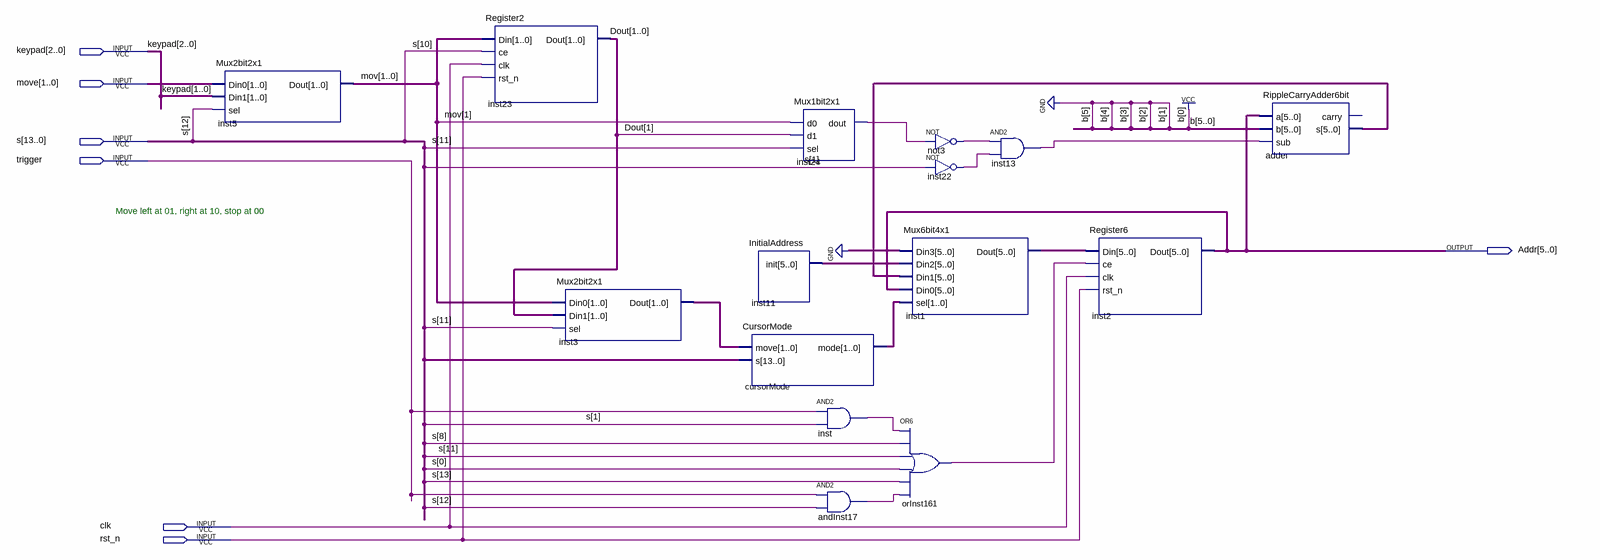
[diagram p0: schematic sheet]
// Quartus schematic Cursor.bdf as structural Verilog: 15 symbols, 7 pins
module Cursor (
  input  [2:0] keypad,
  input  [1:0] move,
  input  [13:0] s,
  input  trigger,
  input  clk,
  input  rst_n,
  output [5:0] Addr
);

  wire andInst17_out, inst13_out, inst22_out, inst24_dout, inst_out, not3_out, orInst161_out;
  wire [1:0] cursorMode_mode, Dout, inst3_dout, mov;
  wire [5:0] adder_s, inst1_dout, inst11_init;

  Mux2bit2x1 inst5 (.Din0(move), .Din1(keypad[1:0]), .sel(s[12]), .Dout(mov));
  Register2 inst23 (.Din(mov), .ce(s[10]), .clk(clk), .rst_n(rst_n), .Dout(Dout));
  Mux2bit2x1 inst3 (.Din0(mov), .Din1(Dout), .sel(s[11]), .Dout(inst3_dout));
  InitialAddress inst11 (.init(inst11_init));
  CursorMode cursorMode (.move(inst3_dout), .s(s), .mode(cursorMode_mode));
  Mux1bit2x1 inst24 (.d0(mov[1]), .d1(Dout[1]), .sel(s[11]), .dout(inst24_dout));
  and inst (inst_out, trigger, s[1]);
  and andInst17 (andInst17_out, trigger, s[12]);
  Mux6bit4x1 inst1 (
    .Din3({6{1'b0}}), .Din2(inst11_init), .Din1(adder_s), .Din0(Addr), .sel(cursorMode_mode),
    .Dout(inst1_dout));
  or orInst161 (orInst161_out, inst_out, s[8], s[11], s[0], s[13], andInst17_out);
  not not3 (not3_out, inst24_dout);
  not inst22 (inst22_out, s[1]);
  and inst13 (inst13_out, not3_out, inst22_out);
  Register6 inst2 (.Din(inst1_dout), .ce(orInst161_out), .clk(clk), .rst_n(rst_n), .Dout(Addr));
  RippleCarryAdder6bit adder (.a(Addr), .b(6'b000001), .sub(inst13_out), .s(adder_s));  // open: carry

  // Notes on the sheet:
  //   Move left at 01, right at 10, stop at 00
endmodule
